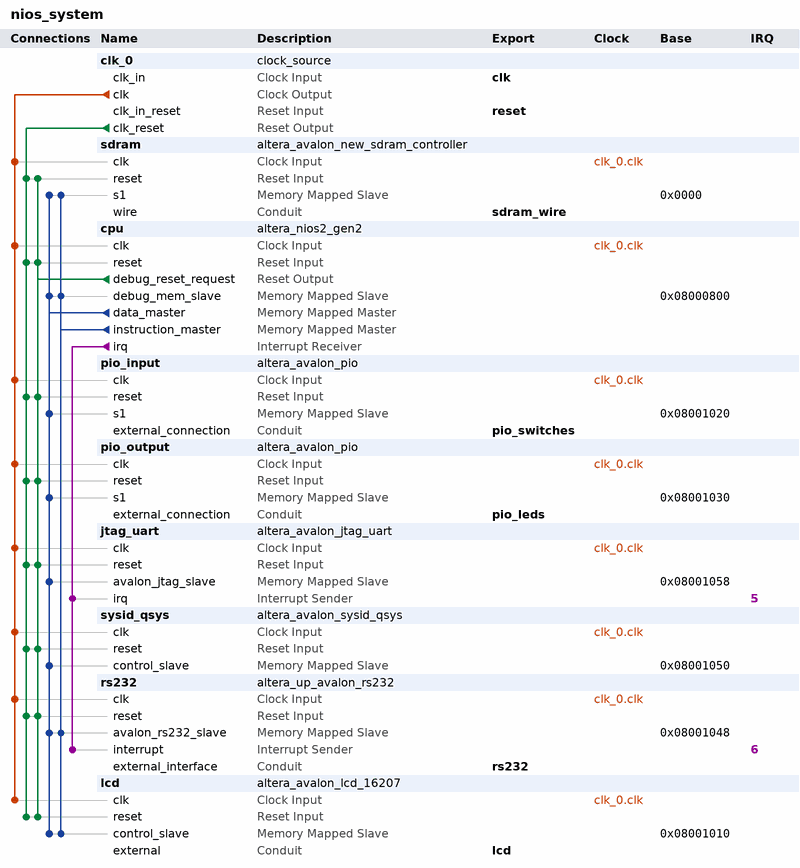
[diagram p0: system contents]
# Platform Designer (Qsys) system nios_system, Cyclone IV E EP4CE115F29C7
# Parameters at their usual value, and those the tool derives, are not listed.
package require -exact qsys 17.0
create_system nios_system
set_project_property DEVICE_FAMILY {Cyclone IV E}
set_project_property DEVICE EP4CE115F29C7

add_instance clk_0 clock_source 17.0
set_instance_parameter_value clk_0 clockFrequency 100000000

add_instance sdram altera_avalon_new_sdram_controller 17.0
set_instance_parameter_value sdram TAC 5.5
set_instance_parameter_value sdram TRCD 20.0
set_instance_parameter_value sdram TRP 20.0
set_instance_parameter_value sdram casLatency 3
set_instance_parameter_value sdram columnWidth 10
set_instance_parameter_value sdram dataWidth 32
set_instance_parameter_value sdram generateSimulationModel false
set_instance_parameter_value sdram model single_Micron_MT48LC4M32B2_7_chip
set_instance_parameter_value sdram numberOfBanks 4
set_instance_parameter_value sdram numberOfChipSelects 1
set_instance_parameter_value sdram powerUpDelay 200.0
set_instance_parameter_value sdram refreshPeriod 7.8125
set_instance_parameter_value sdram rowWidth 13

add_instance cpu altera_nios2_gen2 17.0
set_instance_parameter_value cpu dcache_size 2048
set_instance_parameter_value cpu exceptionSlave sdram.s1
set_instance_parameter_value cpu icache_size 4096
set_instance_parameter_value cpu impl Tiny
set_instance_parameter_value cpu resetSlave sdram.s1

add_instance pio_input altera_avalon_pio 17.0
set_instance_parameter_value pio_input direction Input
set_instance_parameter_value pio_input width 8

add_instance pio_output altera_avalon_pio 17.0
set_instance_parameter_value pio_output direction Output
set_instance_parameter_value pio_output width 16

add_instance jtag_uart altera_avalon_jtag_uart 17.0
set_instance_parameter_value jtag_uart simInteractiveOptions NO_INTERACTIVE_WINDOWS

add_instance sysid_qsys altera_avalon_sysid_qsys 17.0
set_instance_parameter_value sysid_qsys id -559038737

add_instance rs232 altera_up_avalon_rs232 17.0
set_instance_parameter_value rs232 baud 9600
set_instance_parameter_value rs232 parity None

add_instance lcd altera_avalon_lcd_16207 17.0

# connections
add_connection clk_0.clk cpu.clk clock
add_connection clk_0.clk jtag_uart.clk clock
add_connection clk_0.clk lcd.clk clock
add_connection clk_0.clk pio_input.clk clock
add_connection clk_0.clk pio_output.clk clock
add_connection clk_0.clk rs232.clk clock
add_connection clk_0.clk sdram.clk clock
add_connection clk_0.clk sysid_qsys.clk clock
add_connection clk_0.clk_reset cpu.reset reset
add_connection clk_0.clk_reset jtag_uart.reset reset
add_connection clk_0.clk_reset lcd.reset reset
add_connection clk_0.clk_reset pio_input.reset reset
add_connection clk_0.clk_reset pio_output.reset reset
add_connection clk_0.clk_reset rs232.reset reset
add_connection clk_0.clk_reset sdram.reset reset
add_connection clk_0.clk_reset sysid_qsys.reset reset
add_connection cpu.debug_reset_request cpu.reset reset
add_connection cpu.debug_reset_request jtag_uart.reset reset
add_connection cpu.debug_reset_request lcd.reset reset
add_connection cpu.debug_reset_request pio_input.reset reset
add_connection cpu.debug_reset_request pio_output.reset reset
add_connection cpu.debug_reset_request rs232.reset reset
add_connection cpu.debug_reset_request sdram.reset reset
add_connection cpu.debug_reset_request sysid_qsys.reset reset
add_connection cpu.data_master cpu.debug_mem_slave avalon
set_connection_parameter_value cpu.data_master/cpu.debug_mem_slave baseAddress 0x08000800
add_connection cpu.data_master jtag_uart.avalon_jtag_slave avalon
set_connection_parameter_value cpu.data_master/jtag_uart.avalon_jtag_slave baseAddress 0x08001058
add_connection cpu.data_master lcd.control_slave avalon
set_connection_parameter_value cpu.data_master/lcd.control_slave baseAddress 0x08001010
add_connection cpu.data_master pio_input.s1 avalon
set_connection_parameter_value cpu.data_master/pio_input.s1 baseAddress 0x08001020
add_connection cpu.data_master pio_output.s1 avalon
set_connection_parameter_value cpu.data_master/pio_output.s1 baseAddress 0x08001030
add_connection cpu.data_master rs232.avalon_rs232_slave avalon
set_connection_parameter_value cpu.data_master/rs232.avalon_rs232_slave baseAddress 0x08001048
add_connection cpu.data_master sdram.s1 avalon
set_connection_parameter_value cpu.data_master/sdram.s1 baseAddress 0x0000
add_connection cpu.data_master sysid_qsys.control_slave avalon
set_connection_parameter_value cpu.data_master/sysid_qsys.control_slave baseAddress 0x08001050
add_connection cpu.instruction_master cpu.debug_mem_slave avalon
set_connection_parameter_value cpu.instruction_master/cpu.debug_mem_slave baseAddress 0x08000800
add_connection cpu.instruction_master lcd.control_slave avalon
set_connection_parameter_value cpu.instruction_master/lcd.control_slave baseAddress 0x08001010
add_connection cpu.instruction_master rs232.avalon_rs232_slave avalon
set_connection_parameter_value cpu.instruction_master/rs232.avalon_rs232_slave baseAddress 0x08001048
add_connection cpu.instruction_master sdram.s1 avalon
set_connection_parameter_value cpu.instruction_master/sdram.s1 baseAddress 0x0000
add_connection cpu.irq jtag_uart.irq interrupt
set_connection_parameter_value cpu.irq/jtag_uart.irq irqNumber 5
add_connection cpu.irq rs232.interrupt interrupt
set_connection_parameter_value cpu.irq/rs232.interrupt irqNumber 6

# exported interfaces
add_interface clk clock sink
set_interface_property clk EXPORT_OF clk_0.clk_in
add_interface lcd conduit end
set_interface_property lcd EXPORT_OF lcd.external
add_interface pio_leds conduit end
set_interface_property pio_leds EXPORT_OF pio_output.external_connection
add_interface pio_switches conduit end
set_interface_property pio_switches EXPORT_OF pio_input.external_connection
add_interface reset reset sink
set_interface_property reset EXPORT_OF clk_0.clk_in_reset
add_interface rs232 conduit end
set_interface_property rs232 EXPORT_OF rs232.external_interface
add_interface sdram_wire conduit end
set_interface_property sdram_wire EXPORT_OF sdram.wire

set_interconnect_requirement {$system} qsys_mm.clockCrossingAdapter HANDSHAKE
set_interconnect_requirement {$system} qsys_mm.enableEccProtection FALSE
set_interconnect_requirement {$system} qsys_mm.insertDefaultSlave FALSE
set_interconnect_requirement {$system} qsys_mm.maxAdditionalLatency 1

save_system nios_system.qsys
